# EAGLE design dualHbridge-v5 (EAGLE 8.7.1)
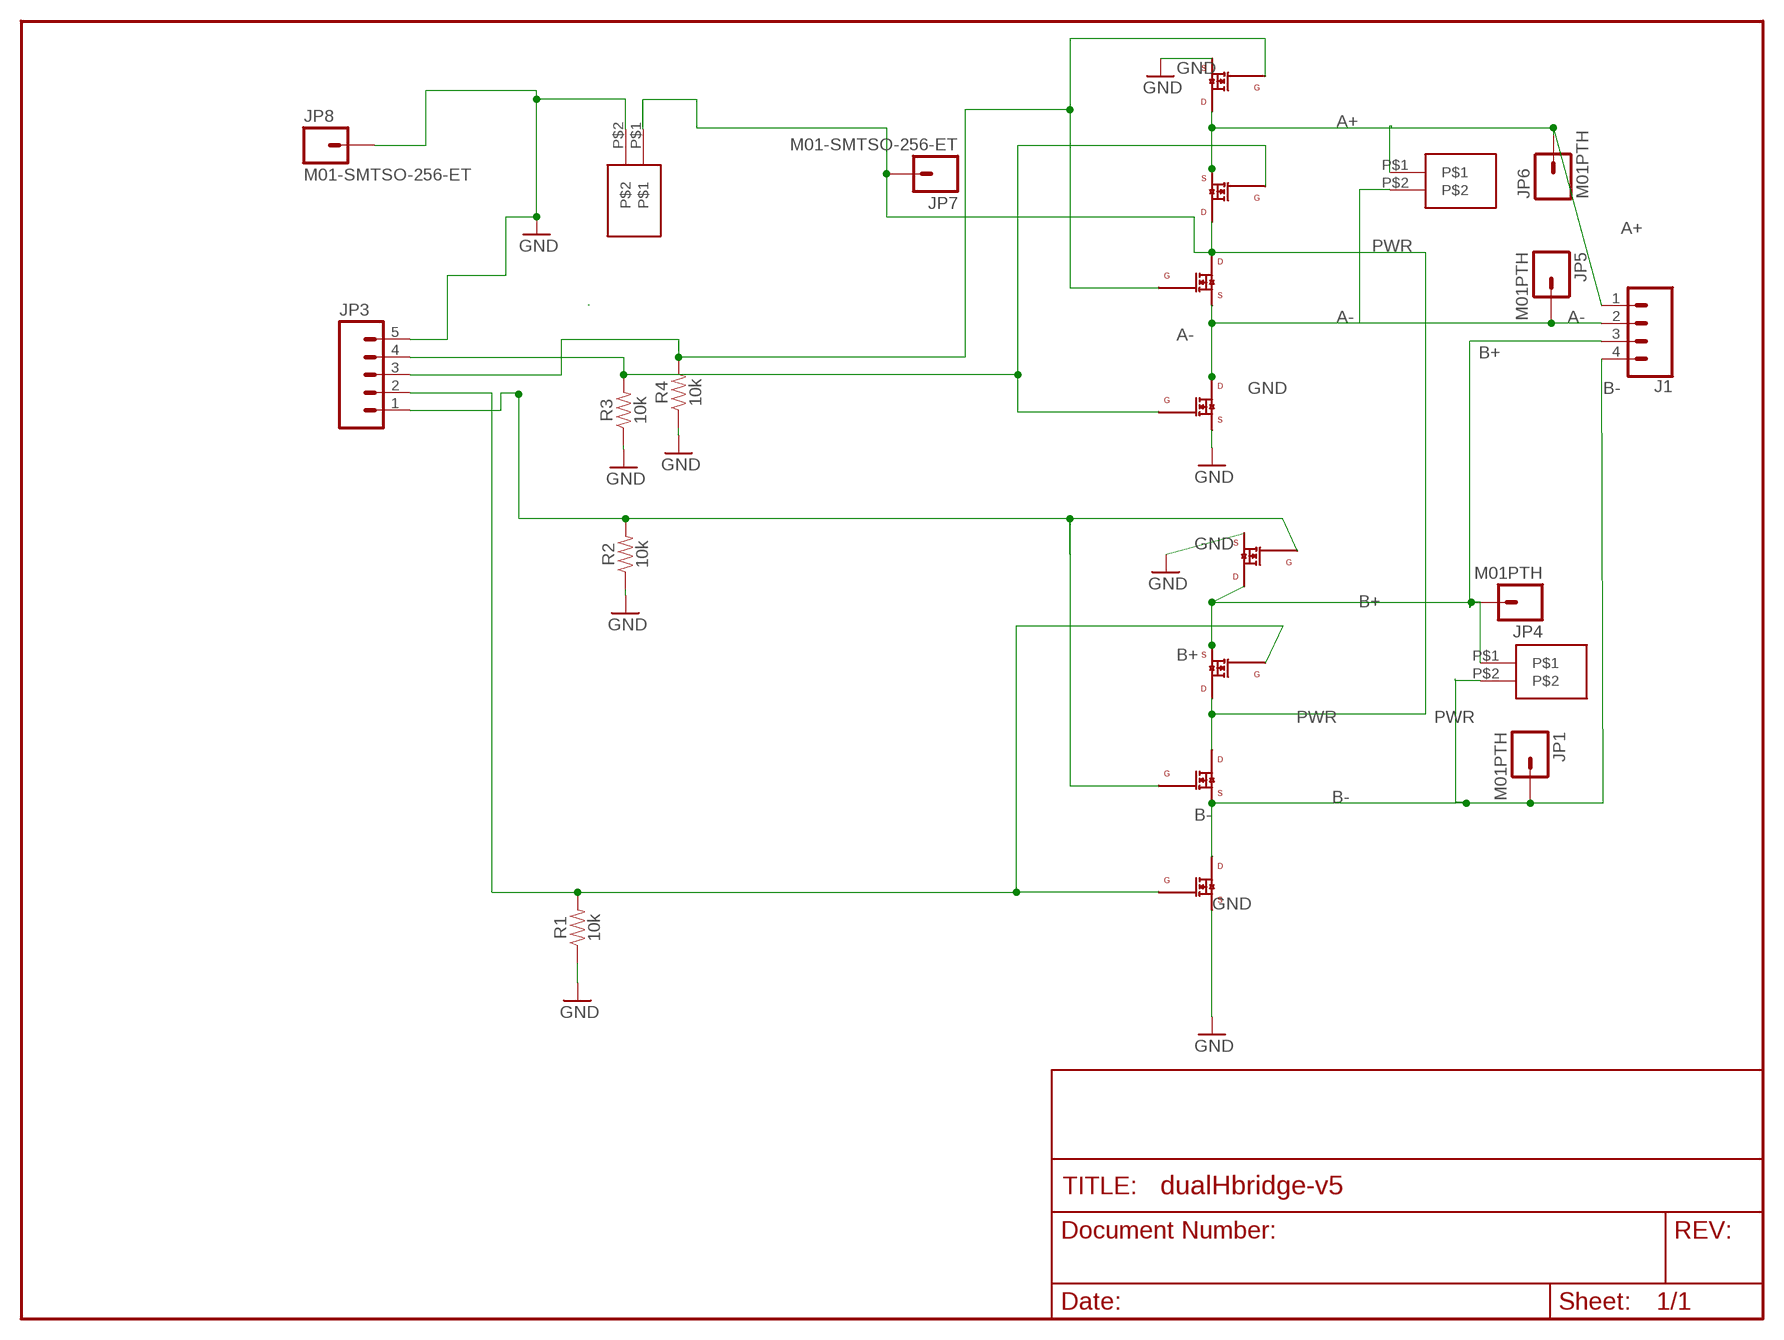
[diagram p0: schematic, sheet 1]

## Parts
J1  CONN_04  [1X04]
JP1  M01PTH  [1X01@1]
JP3  M05PTH  [1X05]
JP4  M01PTH  [1X01@1]
JP5  M01PTH  [1X01@1]
JP6  M01PTH  [1X01@1]
JP7  M01-SMTSO-256-ET  [SMTSO-256-ET]
JP8  M01-SMTSO-256-ET  [SMTSO-256-ET]
Q1  IRLML0060  [SOT-23]
Q2  IRLML0060  [SOT-23]
Q3  IRLML0060  [SOT-23]
Q4  IRLML0060  [SOT-23]
Q5  IRLML0060  [SOT-23]
Q6  IRLML0060  [SOT-23]
Q7  IRLML0060  [SOT-23]
Q8  IRLML0060  [SOT-23]
R1  10k  10KOHM-0603-1/10W-1%  [0603]
R2  10k  10KOHM-0603-1/10W-1%  [0603]
R3  10k  10KOHM-0603-1/10W-1%  [0603]
R4  10k  10KOHM-0603-1/10W-1%  [0603]
X1  SPRING-TERMINAL  [SPRING-TERMINAL]
X2  SPRING-TERMINAL  [SPRING-TERMINAL]
X3  SPRING-TERMINAL  [SPRING-TERMINAL]

## Nets
A+: J1.1 JP6.1 Q1.3(DRAIN) Q2.2(SOURCE) X1.P$1
A-: J1.2 JP5.1 Q3.2(SOURCE) Q4.3(DRAIN) X1.P$2
B+: J1.3 JP4.1 Q5.3(DRAIN) Q6.2(SOURCE) X2.P$1
B-: J1.4 JP1.1 Q7.2(SOURCE) Q8.3(DRAIN) X2.P$2
GND: JP3.5 JP8.P$1 Q1.2(SOURCE) Q4.2(SOURCE) Q5.2(SOURCE) Q8.2(SOURCE) R1.1 R2.1 R3.1 R4.1 X3.P$2
N$5: JP3.4 Q2.1(GATE) Q4.1(GATE) R3.2
N$6: JP3.3 Q1.1(GATE) Q3.1(GATE) R4.2
N$13: JP3.1 Q5.1(GATE) Q7.1(GATE) R2.2
N$14: JP3.2 Q6.1(GATE) Q8.1(GATE) R1.2
PWR: JP7.P$1 Q2.3(DRAIN) Q3.3(DRAIN) Q6.3(DRAIN) Q7.3(DRAIN) X3.P$1

## Library data of the parts
J1 = SparkFun-Connectors:CONN_04: Multi connection point. Often used as Generic Header-pin footprint for 0.1 inch spaced/style header connections On any of the 0.1 inch spaced packages, you can populate with these: Break Away Headers - Straight <https://www.sparkfun.com/products/116> (PRT-00116) Break Away Male Headers - Right Angle <https://www.sparkfun.com/products/553> (PRT-00553) Female Headers <https://www.sparkfun.com/products/115> (PRT-00115) Break Away Headers - Machine Pin <https://www.sparkfun.com/products/117> (PRT-00117) Break Away Female Headers - Swiss Machine Pin <https://www.sparkfun.com/products/743> (PRT-00743) For SCREWTERMINALS and SPRING TERMINALS visit here: Screw Terimnals on SparkFun.com <https://www.sparkfun.com/search/results?term=Screw+Terminals> (5mm/3.5mm/2.54mm spacing) This device is also useful as a general connection point to wire up your design to another part of your project. Our various solder wires solder well into these plated through hole pads. Hook-Up Wire - Assortment (Stranded, 22 AWG) <https://www.sparkfun.com/products/11375> (PRT-11375) Hook-Up Wire - Assortment (Solid Core, 22 AWG) <https://www.sparkfun.com/products/11367> (PRT-11367) View the entire wire category on our website here <https://www.sparkfun.com/categories/141> Special notes: Molex polarized connector foot print use with SKU : PRT-08231 with associated crimp pins and housings. 1MM SMD Version SKU: PRT-10208; PROD_ID: CONN-09696
JP1 JP4-JP8 = SparkFun-Connectors:M01: Header 1 Standard 1-pin 0.1" header. Use with straight break away headers (SKU : PRT-00116), right angle break away headers (PRT-00553), swiss pins (PRT-00743), machine pins (PRT-00117), and female headers (PRT-00115).
JP3 = SparkFun-Connectors:M05: Header 5 Standard 5-pin 0.1" header. Use with straight break away headers (SKU : PRT-00116), right angle break away headers (PRT-00553), swiss pins (PRT-00743), machine pins (PRT-00117), and female headers (PRT-00115). Molex polarized connector foot print use with SKU : PRT-08230 with associated crimp pins and housings.
Q1-Q8 = spietz-library:IRLML0060
R1-R4 = SparkFun-Resistors:10KOHM: 10kΩ resistor A resistor is a passive two-terminal electrical component that implements electrical resistance as a circuit element. Resistors act to reduce current flow, and, at the same time, act to lower voltage levels within circuits. - Wikipedia; PROD_ID: RES-00824
X1-X3 = spietz-library:SPRING-TERMINAL

## Net classes
0 default: width 0.203 mm
1 vcc: width 0.254 mm

## Board
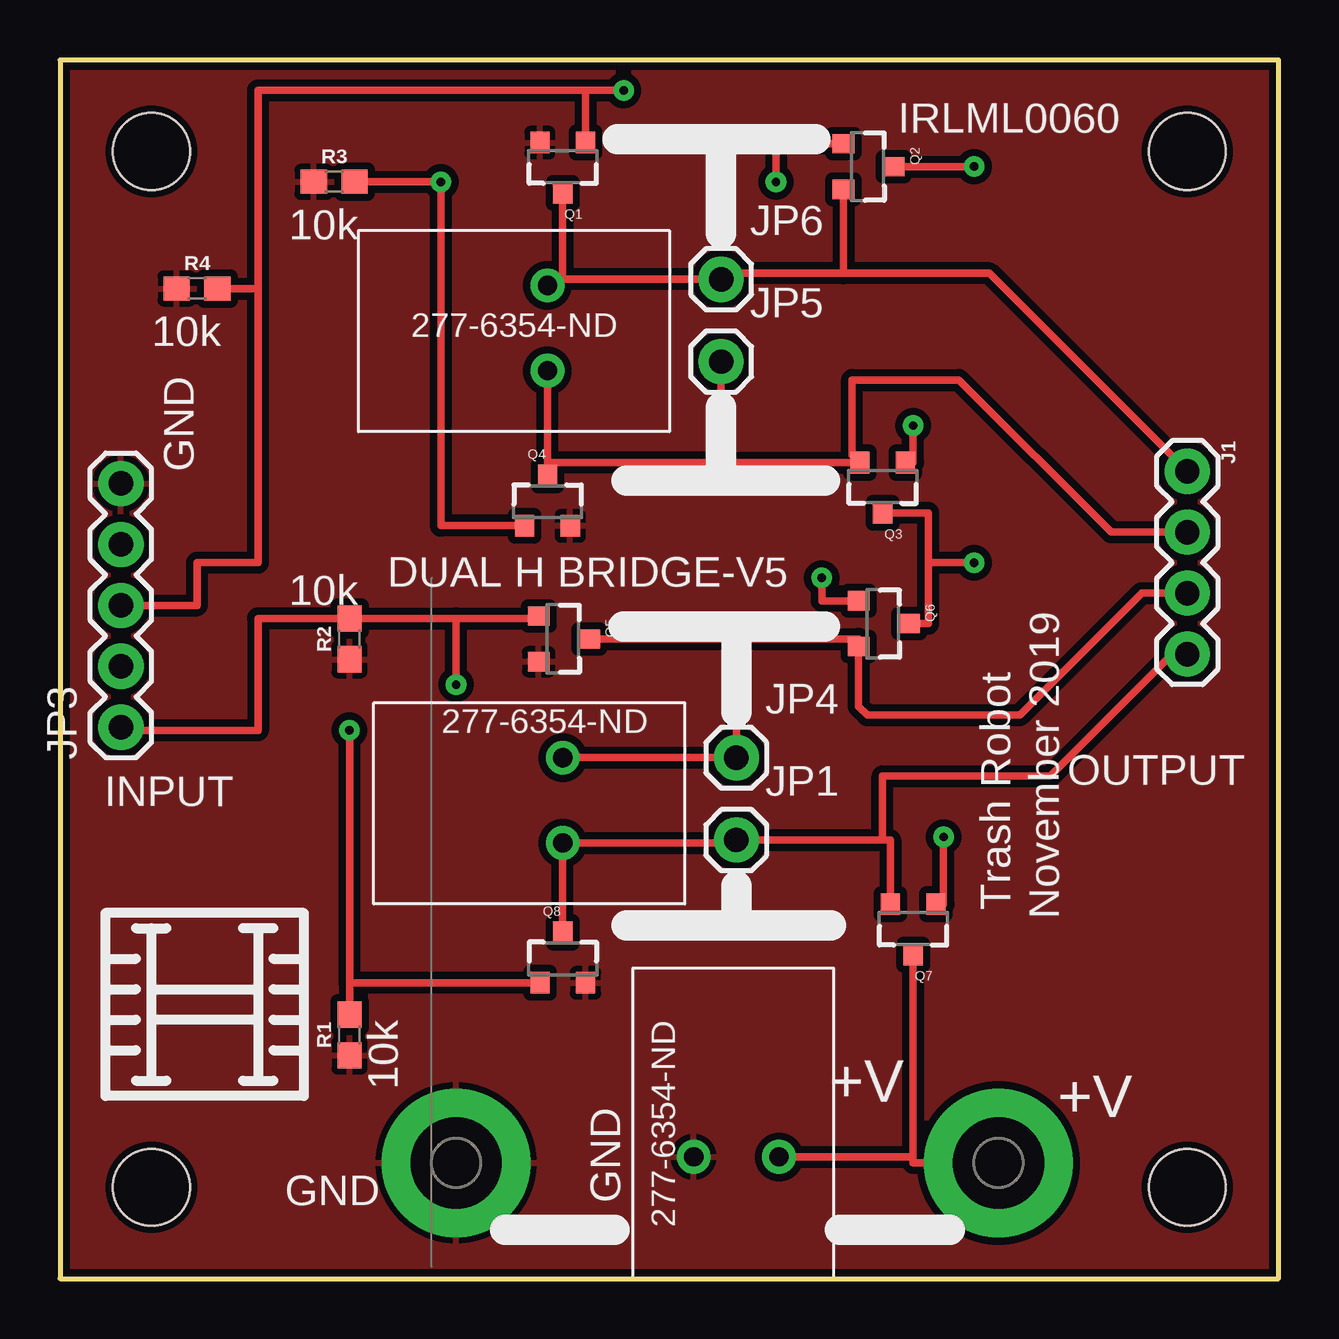
[diagram p1: board, top side]
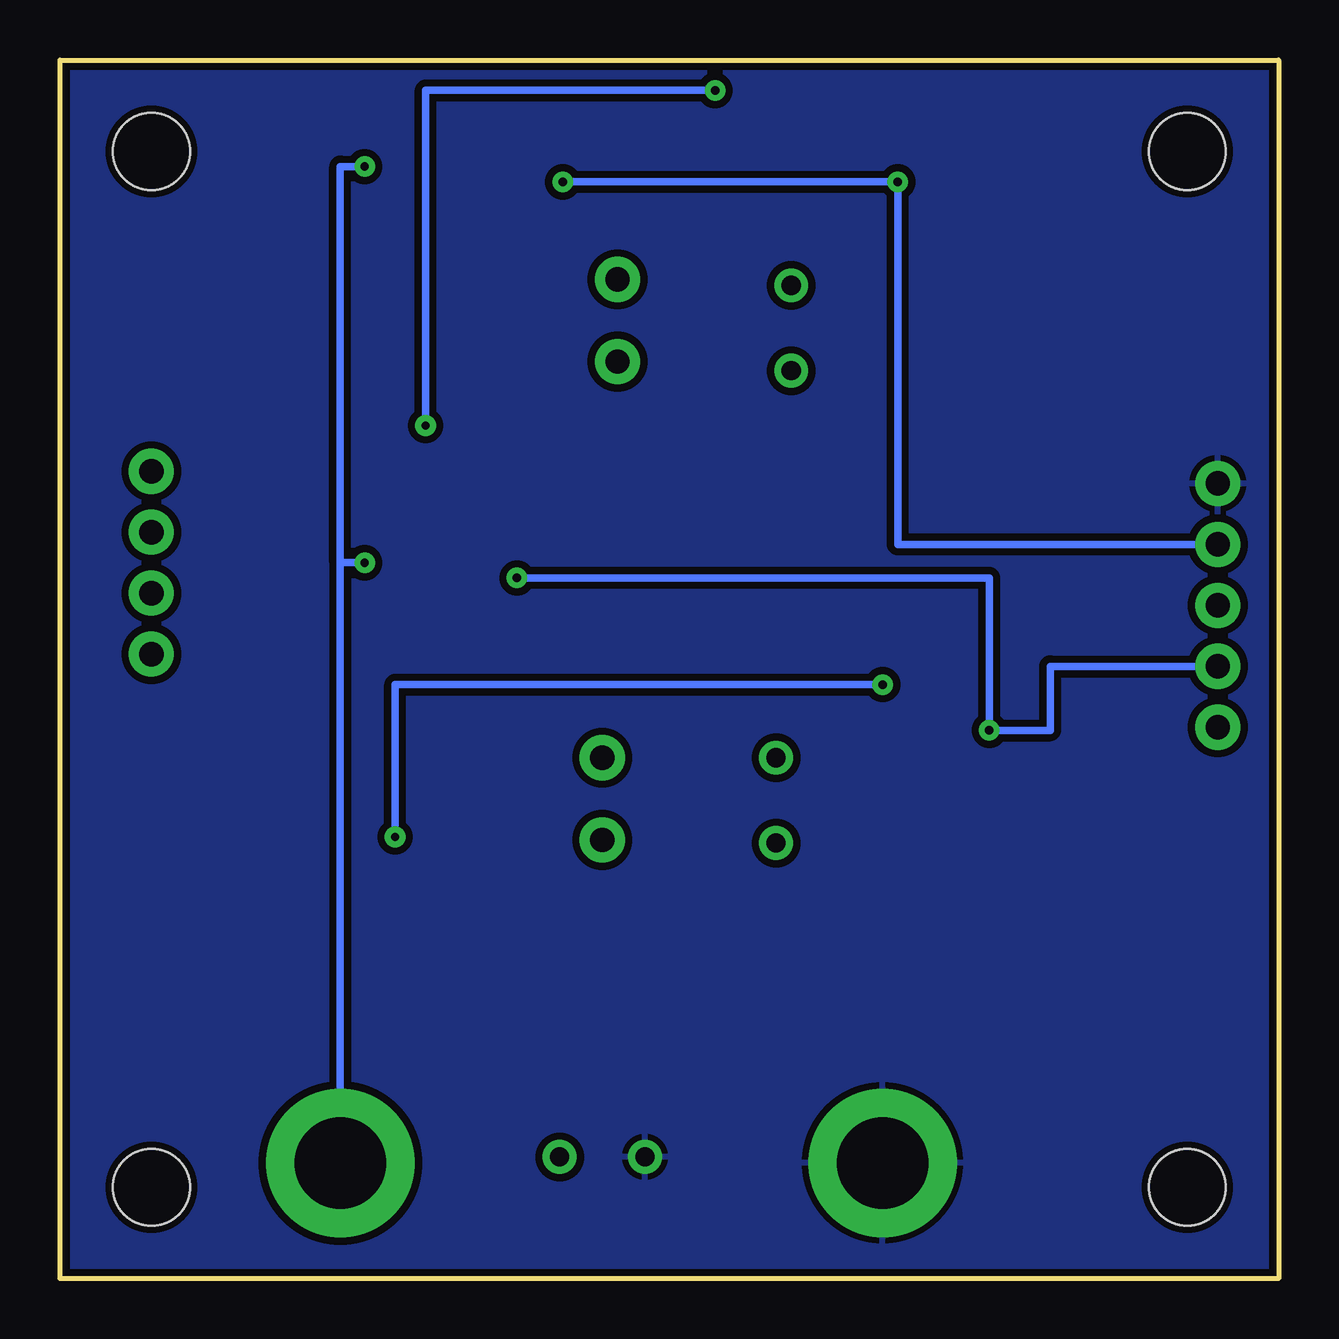
[diagram p2: board, bottom side, seen from below]

Size 50.8 x 50.8 mm. Coordinates in mm from the lower left corner, seen from the top.
Outline: 0,50.8 0,0 50.8,0 50.8,50.8 0,50.8
Copper layers (1*16): Top 0.035mm / dielectric 1.5mm / Bottom 0.035mm
Design rules "SparkFun": minimum track width 8mil, minimum drill 20mil, track to track 8mil, track to pad 8mil, pad to pad 8mil, via to via 8mil, smd to smd 8mil, copper to edge 10mil, drill to drill 8mil, minimum pad ring 12mil, minimum via ring 10mil, stop-mask expansion 4mil, vias tented up to drill 25mil, thermal gap 10mil
Holes 3.2 mm at 3.81,46.99 46.99,46.99 3.81,3.81 46.99,3.81

### Footprints (pad centres in the part's own frame; a part is rotated, then mirrored left to right if it is on the bottom)
1X04 = drill 1.016 pad 1.88: 1 0,0; 2 2.54,0; 3 5.08,0; 4 7.62,0
1X01@1 = drill 1.016 pad 1.88: 1 0,0
1X05 = drill 1.016 pad 1.88: 1 0,0; 2 2.54,0; 3 5.08,0; 4 7.62,0; 5 10.16,0
SMTSO-256-ET = drill 3.81 pad 6.198: P$1 0,0
SOT-23 = smd 0.8 x 0.9: 1 -0.95,-1; 2 0.95,-1; 3 0,1.1
0603 = smd 1.1 x 1: 1 -0.85,0; 2 0.85,0
SPRING-TERMINAL = drill 0.8: P$1 5.08,1.778; P$2 5.08,5.334

### Placement (x,y rotation side)
J1  46.99,33.66 270 top
JP1  28.19,18.29 0 top
JP3  2.54,22.99 90 top
JP4  28.19,21.72 0 top
JP5  27.56,38.23 0 top
JP6  27.56,41.66 0 top
JP7  39.12,4.83 0 top
JP8  16.51,4.83 0 top
Q1  20.95,46.35 180 top
Q2  33.66,46.35 270 top
Q3  34.29,33.02 180 top
Q4  20.32,32.38 0 top
Q5  20.95,26.67 270 top
Q6  34.29,27.3 270 top
Q7  35.56,14.61 180 top
Q8  20.95,13.34 0 top
R1  12.06,10.16 90 top
R2  12.06,26.67 90 top
R3  11.43,45.72 0 top
R4  5.71,41.27 0 top
X1  25.4,43.18 180 top
X2  26.04,23.5 180 top
X3  31.75,0 90 top

### Tracks (layer width: path | path; a pad name or v marks a point on that pad's centre or on a via)
A+
  Top 0.305: J1.1 38.73,41.91 32.66,41.91 | 32.66,41.91 27.56,41.91 JP6.1 20.95,41.66 | Q2.2 32.66,41.91 | 20.95,41.66 20.32,41.66 X1.P$1 | Q1.3 20.95,41.66
A-
  Top 0.305: Q4.3 20.32,34.02 | 20.32,34.02 X1.P$2 20.32,38.23 | JP5.1 27.56,34.02 | 27.56,34.02 Q3.2 33.02,34.34 33.02,37.47 37.47,37.47 43.81,31.11 J1.2 | 27.56,34.02 20.32,34.02
B+
  Top 0.305: J1.3 45.09,28.57 40.01,23.5 33.66,23.5 33.29,23.86 Q6.2 33.29,26.67 28.19,26.67 | Q5.3 28.19,26.67 | 28.19,26.67 JP4.1 X2.P$1
B-
  Top 0.305: Q8.3 X2.P$2 28.19,18.16 JP1.1 34.29,18.29 | 34.29,18.29 34.61,18.29 Q7.2 | 34.29,18.29 34.29,20.95 41.27,20.95 46.35,26.04 J1.4
GND
  pour Top (isolate 0.305): -1.91,53.34 53.34,53.34 53.34,-1.91 -1.91,-1.91
  pour Bottom (isolate 0.305): -1.27,52.07 52.07,52.07 52.07,-1.27 -1.27,-1.27
N$5  (via drill 0.35)
  Top 0.305: Q2.1 29.84,47.3 v29.84,45.72 | R3.2 v15.88,45.72 15.88,31.39 Q4.1
  Bottom 0.305: v29.84,45.72 v15.88,45.72 15.88,30.61 JP3.4
N$6  (via drill 0.35)
  Top 0.305: JP3.3 5.71,28.07 5.71,29.84 8.26,29.84 8.26,41.27 | 8.26,41.27 8.26,49.53 21.91,49.53 | 21.91,49.53 Q1.1 | Q3.1 35.56,34.02 v35.56,35.56 | 21.91,49.53 v23.5,49.53 | R4.2 8.26,41.27
  Bottom 0.305: v35.56,35.56 35.56,49.53 v23.5,49.53
N$13  (via drill 0.35)
  Top 0.305: 16.51,27.52 R2.2 8.26,27.52 8.26,22.86 2.54,22.86 JP3.1 | 16.51,27.52 19.95,27.52 Q5.1 | Q7.1 36.83,15.61 v36.83,18.41 | v16.51,24.77 16.51,27.52
  Bottom 0.305: v36.83,18.41 36.83,24.77 v16.51,24.77
N$14  (via drill 0.35)
  Top 0.305: Q8.1 12.06,12.34 | 12.06,12.34 R1.2 | 12.06,12.34 v12.06,22.86 | Q6.1 31.75,28.25 v31.75,29.21
  Bottom 0.305: JP3.2 9.53,25.53 9.53,22.86 v12.06,22.86 12.06,29.21 v31.75,29.21
PWR  (via drill 0.35)
  Top 0.305: Q7.3 35.56,5.08 | 35.56,5.08 35.56,4.83 JP7.P$1 | X3.P$1 35.56,5.08 | Q6.3 36.2,27.3 36.2,29.84 | Q3.3 36.2,31.92 36.2,29.84 | 36.2,29.84 v38.1,29.84 | Q2.3 v38.1,46.35
  Bottom 0.305: v38.1,29.84 39.12,29.84 | 39.12,29.84 JP7.P$1 | 39.12,29.84 39.12,46.35 v38.1,46.35

### Text on the board
tPlace: IRLML0060 | 10k | 277-6354-ND | 10k | GND | DUAL H BRIDGE-V5 | 10k | November 2019 | 277-6354-ND | OUTPUT | INPUT | Trash Robot | 10k | V+ | V+ | GND | GND | 277-6354-ND
tValues: Tent Vias! | Arduino Wee v1.3